# Altium project PCB_Project.PrjPcb
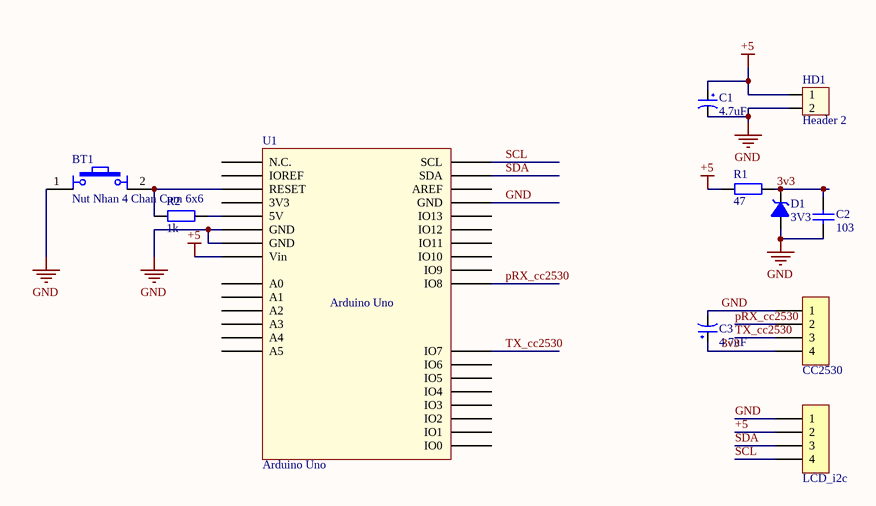
[diagram p0: Sheet1.SchDoc]
1 sheet, 11 parts. Net scope: global (net labels, ports and power ports of the same name join across sheets).
Board file: PCB1.PcbDoc

## Sheet Sheet1.SchDoc
size A

### Parts
BT1  Nut Nhan 4 Chan Cam 6x6  [Nut Nhan 4 Chan Cam 6x6]
C1  4.7uF  [tu hoa 8mm]
C2  103  [tu gom]
C3  4.7uF  [tu hoa 8mm]
D1  3V3  [DZ2A]
H1  CC2530  [XH2.54M-4]
H2  LCD_i2c  [XH2.54M-4]
HD1  Header 2  [HED2]
R1  47  [tro vach 1/4w]
R2  1k  [tro vach 1/4w]
U1  Arduino Uno  [Arduino Uno]

### Nets
+5: C1.1 H2.2 HD1.1 R1.1 U1.Vin
GND: BT1.1 C1.2 C2.2 C3.2 D1.1(A) H1.1 H2.1 HD1.2 U1.GND1(GND) U1.GND2(GND) U1.GND3(GND)
3v3: C2.1 C3.1 D1.2(K) H1.4 R1.2
pRX_cc2530: H1.2 U1.8(IO8)
SCL: H2.4 U1.SCL
SDA: H2.3 U1.SDA
TX_cc2530: H1.3 U1.7(IO7)
NetBT1_2: BT1.2 R2.1
NetR2_2: R2.2 U1.5V

Not connected (* = marked no-connect by the designer): U1 0(IO0) 1(IO1) 2(IO2) 3(IO3) 3V3 4(IO4) 5(IO5) 6(IO6) 9(IO9) 10(IO10) 11(IO11) 12(IO12) 13(IO13) A0 A1 A2 A3 A4 A5 AREF IOREF NC(N.C.) RESET

### Library data of the parts
BT1 = Nut Nhan 4 Chan Cam 6x6: Nut Nhan 4 Chan 6x6mm; Ten: Nút Nhấn 4 Chân 6x6x5MM DIP; Ma_Hang: MH004584
C1 C3 = Tu Hoa 4.7uF 400V 8x12: Cắm; Don_Vi: Con; So_Chan: 2; Ten_Linh_Kien: Tụ Hóa 4.7uF 400V 8x12MM; Ma_Hang: MH003744; Chung_Loai: Cắm; Kieu_Chan: *
C2 = Tu gom 103 50V: Cắm; So_Chan: 2; Ten_Linh_Kien: Tụ gốm 103 10nF 50V; Don_Vi: Con; Ma_Hang: MH000936; Chung_Loai: Cắm; Kieu_Chan: *
D1 = DZ: Diode Zenner; Value: 3v3
H1 H2 = Header 4P 2.54 Duc Thang: Cắm; Ten_Linh_Kien: Header 4P XH2.54-4P Đực Thẳng; Don_Vi: Con; Ma_Hang: MH001285; Chung_Loai: Cắm
HD1 = Header 2: Header 2 (Green); Value: Header 2
R1 = Tro Vach 1/4W 5% 330k: Cắm; Don_Vi: Con; So_Chan: 2; Ten_Linh_Kien: Trở Vạch 1/4w 5% 330k; Ma_Hang: MH007312; Chung_Loai: Cắm; Kieu_Chan: *
R2 = Tro Vach 1/4W 5% 39R: Cắm; So_Chan: 2; Don_Vi: Con; Ten_Linh_Kien: Trở Vạch 1/4w 5% 39R; Ma_Hang: MH007315; Chung_Loai: Cắm; Kieu_Chan: *